# Altium schematic sheet Control_core.SchDoc
size 594 x 420 mm; SheetNumber: 3; SheetTotal: 3
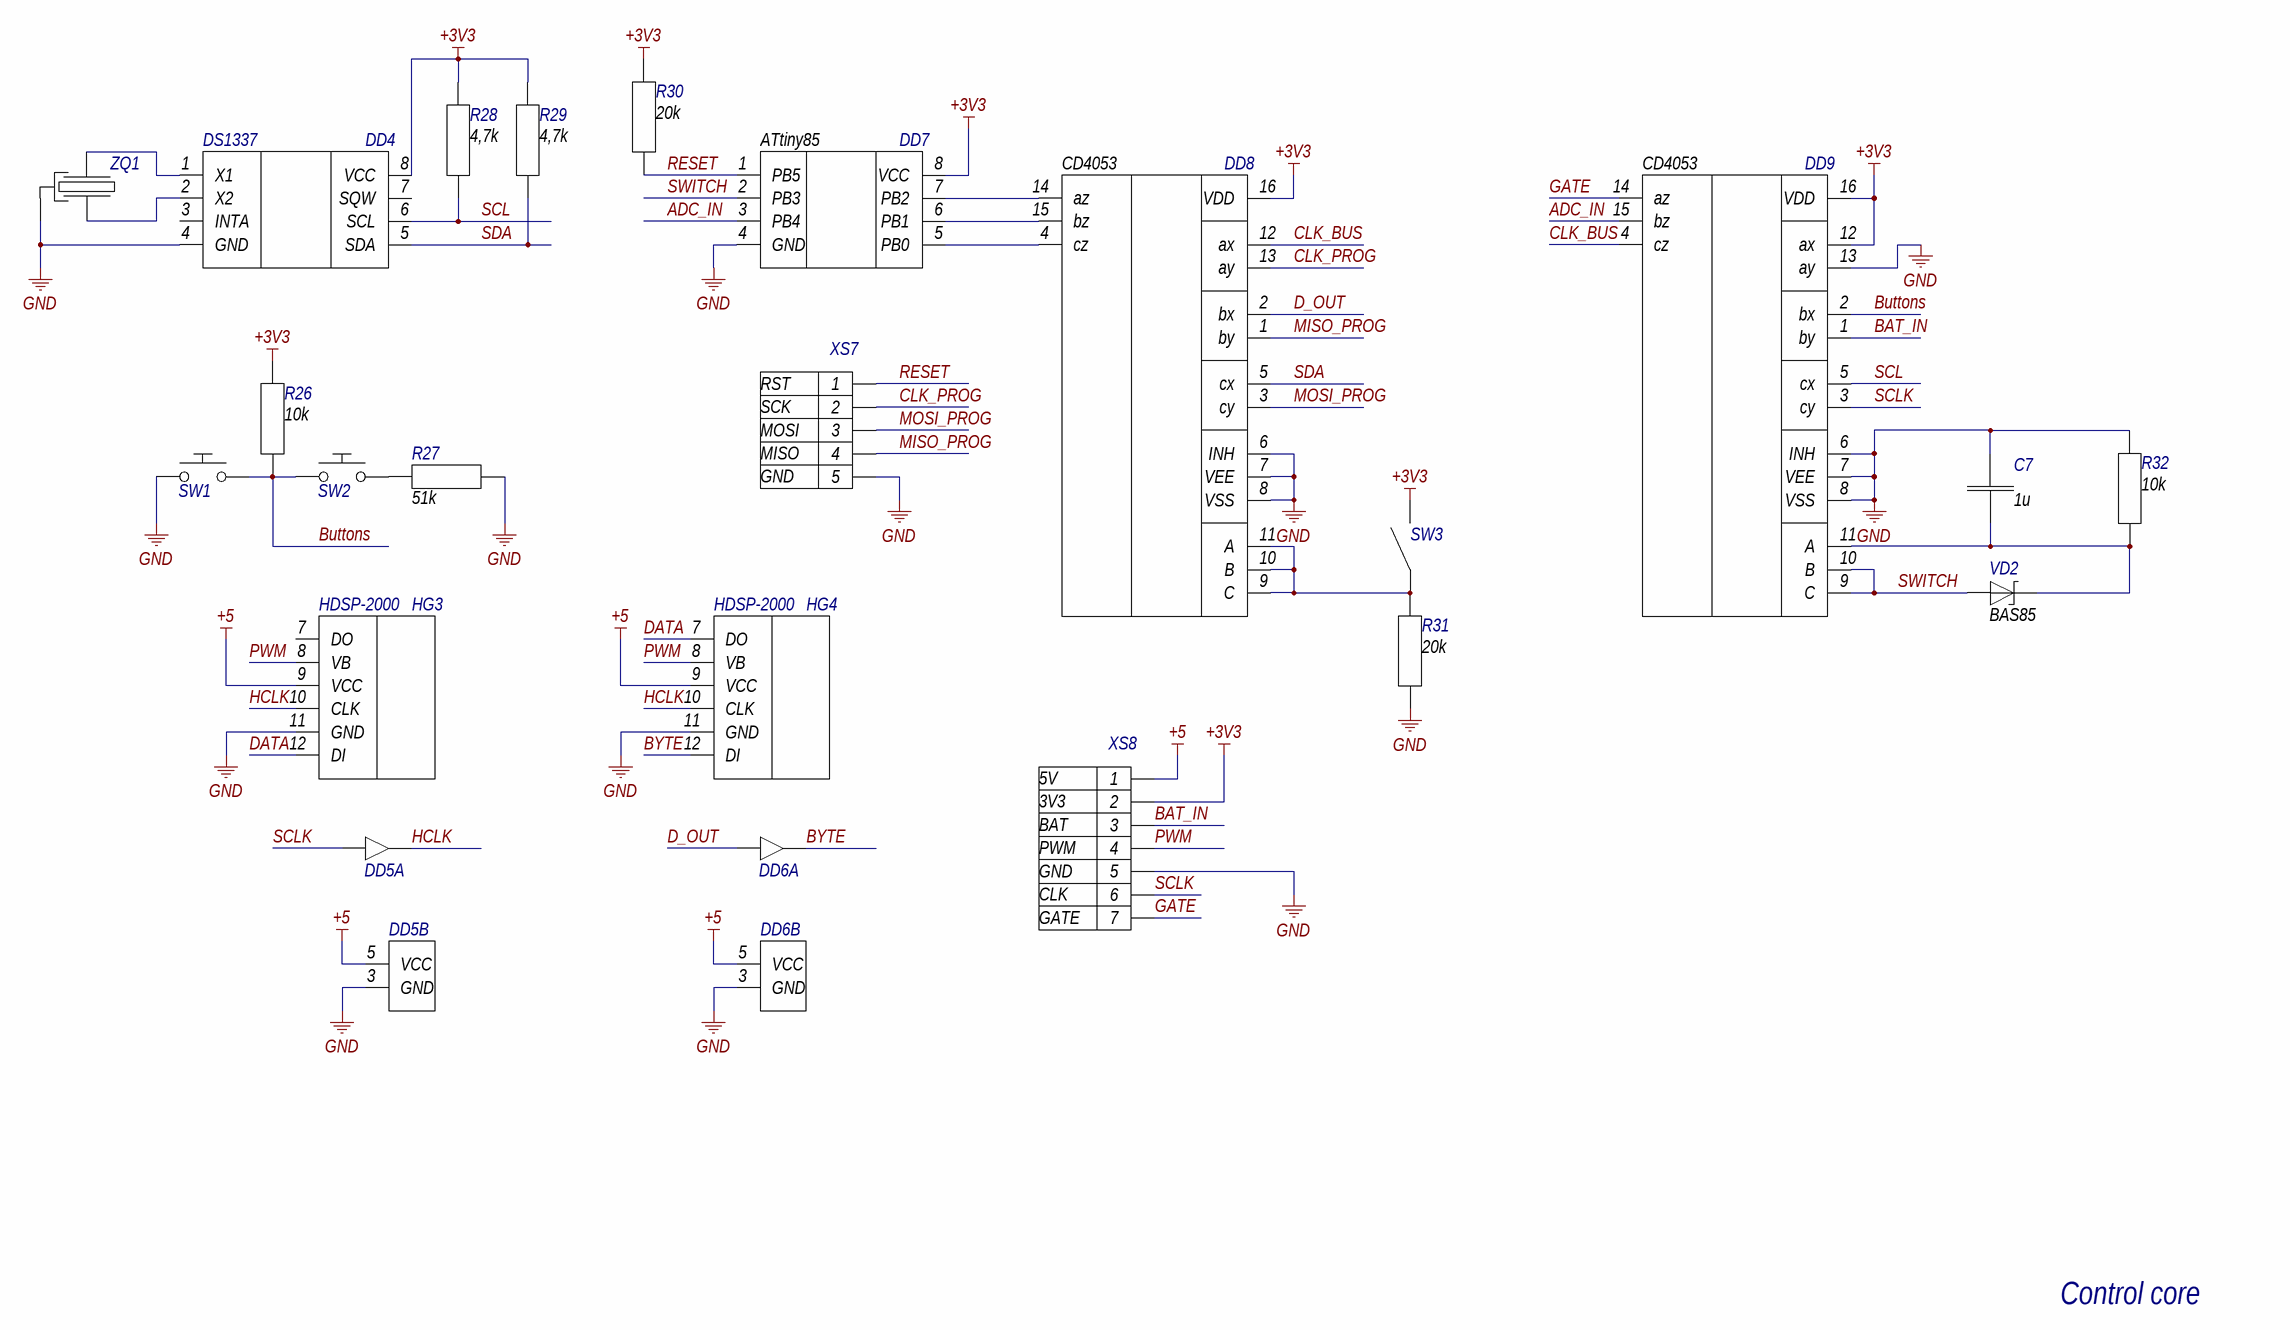
[diagram p0: Control_core.SchDoc]

## Parts
C7  value 1u  [CHIP-0805]  (hidden comment: C0805)
DD4  DS1337  [SOIC-8]
DD5  74LV1T34  [SOT23-5]  (value not drawn)  (parts A,B of 2)
DD6  74LV1T34  [SOT23-5]  (value not drawn)  (parts A,B of 2)
DD7  ATtiny85  [SOIC-8-ATtiny85]
DD8  CD4053  [SOIC-16]
DD9  CD4053  [SOIC-16]
HG3  Name: HDSP-2000  [HDSP-2000_SPI]  (hidden comment: HDSP-2000_SPI)
HG4  Name: HDSP-2000  [HDSP-2000_SPI]  (hidden comment: HDSP-2000_SPI)
R26  value 10k  [CHIP-0402]  (hidden comment: R0402)
R27  value 51k  [CHIP-0402]  (hidden comment: R0402)
R28  value 4,7k  [CHIP-0402]  (hidden comment: R0402)
R29  value 4,7k  [CHIP-0402]  (hidden comment: R0402)
R30  value 20k  [CHIP-0402]  (hidden comment: R0402)
R31  value 20k  [CHIP-0402]  (hidden comment: R0402)
R32  value 10k  [CHIP-0402]  (hidden comment: R0402)
SW1  Button  [BUTTON]  (value not drawn)
SW2  Button  [BUTTON]  (value not drawn)
SW3  Switch  [SWITCH]  (value not drawn)
VD2  BAS85  [DIOD_MELF]
XS7  Prog_connector  [Prog_connector]  (value not drawn)
XS8  Pin7: GATE  Pin6: CLK  Pin5: GND  Pin4: PWM  Pin3: BAT  Pin2: 3V3  Pin1: 5V  [SOCKET_7]  (hidden comment: Socket_7)
ZQ1  HZ  [HZ]  (value not drawn)

## Nets
+3V3: DD4.8(VCC) DD7.8(VCC) DD8.16(VDD) DD9.12(ax) DD9.16(VDD) R26.2 R28.2 R29.2 R30.2 SW3.2 XS8.2
+5: DD5.5(VCC) DD6.5(VCC) HG3.9(VCC) HG4.9(VCC) XS8.1
GND: C7.2 DD4.4(GND) DD5.3(GND) DD6.3(GND) DD7.4(GND) DD8.6(INH) DD8.7(VEE) DD8.8(VSS) DD9.6(INH) DD9.7(VEE) DD9.8(VSS) DD9.13(ay) HG3.11(GND) HG4.11(GND) R27.2 R31.2 R32.2 SW1.1 XS7.5 XS8.5 ZQ1.3
ADC_IN: DD7.3(PB4) DD9.15(bz)
BAT_IN: DD9.1(by) XS8.3
Buttons: DD9.2(bx) R26.1 SW1.2 SW2.1
BYTE: DD6.4(OUT) HG4.12(DI)
CLK_BUS: DD8.12(ax) DD9.4(cz)
CLK_PROG: DD8.13(ay) XS7.2
D_OUT: DD6.2(IN) DD8.2(bx)
DATA: HG3.12(DI) HG4.7(DO)
GATE: DD9.14(az) XS8.7
HCLK: DD5.4(OUT) HG3.10(CLK) HG4.10(CLK)
MISO_PROG: DD8.1(by) XS7.4
MOSI_PROG: DD8.3(cy) XS7.3
PWM: HG3.8(VB) HG4.8(VB) XS8.4
RESET: DD7.1(PB5) R30.1 XS7.1
SCL: DD4.6(SCL) DD9.5(cx) R28.1
SCLK: DD5.2(IN) DD9.3(cy) XS8.6
SDA: DD4.5(SDA) DD8.5(cx) R29.1
SWITCH: DD7.2(PB3) DD9.9(C) DD9.10(B) VD2.2(A)
NetC7_1: C7.1 DD9.11(A) R32.1 VD2.1(K)
NetDD4_1: DD4.1(X1) ZQ1.1
NetDD4_2: DD4.2(X2) ZQ1.2
NetDD7_5: DD7.5(PB0) DD8.4(cz)
NetDD7_6: DD7.6(PB1) DD8.15(bz)
NetDD7_7: DD7.7(PB2) DD8.14(az)
NetDD8_9: DD8.9(C) DD8.10(B) DD8.11(A) R31.1 SW3.1
NetR27_1: R27.1 SW2.2

Not connected (* = marked no-connect by the designer): DD4 3(INTA) 7(SQW); HG3 7(DO)

## Notes on the sheet
- Control core
- Перв. застосув.
- Справ. №
- Підп. дата
- Інв. № дубл.
- Взам. інв. №
- Підп. та дата
- Зм.
- Розроб.
- Арк.
- № докум.
- Підп.
- Дата
- Літ.
- Маса
- Маштаб
- Перев.
- Аркушів
- Інв. № подл.
- Н.контр.
- Затв.
- КПІ ім. Ігоря Сікорського
- ALTIUM GOSTBOM2.0 KEV
- Копіював
- Формат А2
- (in symbol Prog_connector) RST; SCK; MOSI; MISO; GND

## Library data of the parts
DD4 = DS1337: Manufacturer: Maxim; Name: DS1337
HG3 HG4 = HDSP-2000_SPI: Manufacturer: HP
DD7 = ATtiny85: Name: ATtiny85
DD8 DD9 = CD4053: Name: CD4053
VD2 = BAS85: Name: BAS85